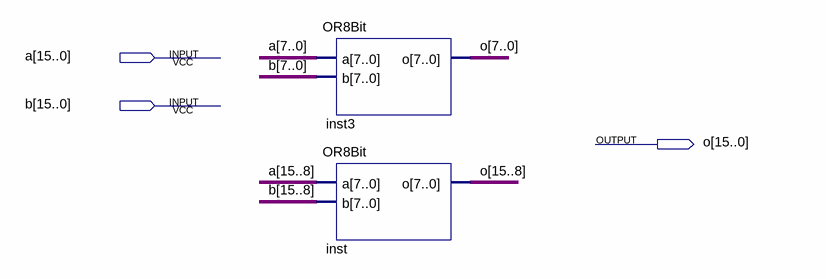
[diagram p0: schematic sheet]
// Quartus schematic OR16.bdf as structural Verilog: 2 symbols, 3 pins
module OR16 (
  input  [15:0] a,
  input  [15:0] b,
  output [15:0] o
);

  OR8Bit inst3 (.a(a[7:0]), .b(b[7:0]), .o(o[7:0]));
  OR8Bit inst (.a(a[15:8]), .b(b[15:8]), .o(o[15:8]));
endmodule
